# Altium schematic sheet Switches + Blocks.SchDoc
size A3; SheetNumber: 1; SheetTotal: 2
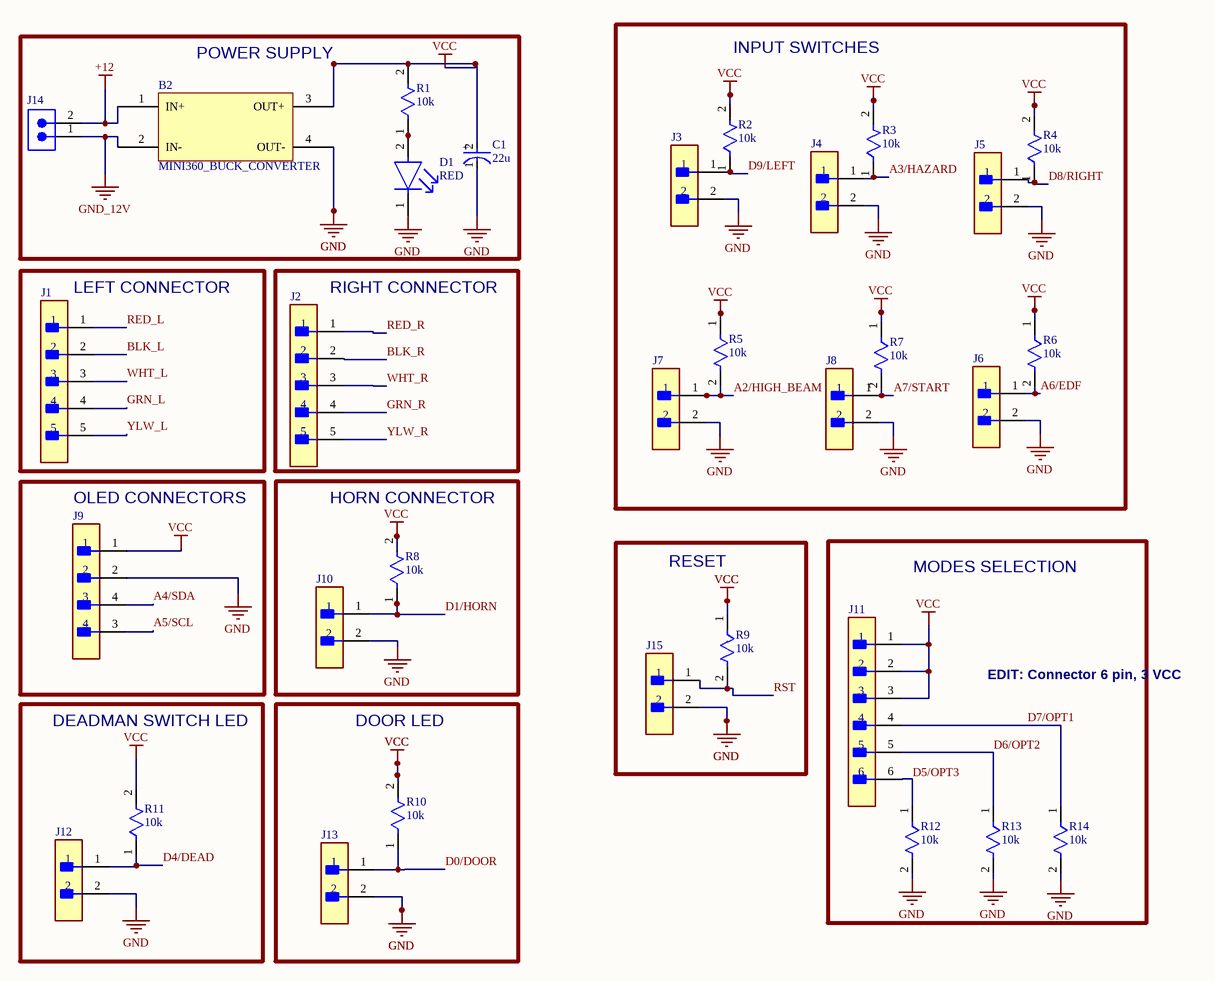
[diagram p0: Switches + Blocks.SchDoc]

## Parts
B2  MINI360_BUCK_CONVERTER  [MINI360_BUCK_CONVERTER]
C1  22u  [FP-RAD-TH-D_5_0_5-L_11_1-MFG]
D1  RED  [FP-6_544-5255_01-4-MFG]
J1  B5B-XH-AM(LF)(SN)  [FP-B5B-XH-AM_LF_SN-MFG]  (value not drawn)
J2  B5B-XH-AM(LF)(SN)  [FP-B5B-XH-AM_LF_SN-MFG]  (value not drawn)
J3  B2B-XH-A(LF)(SN)  [FP-B2B-XH-A_LF_SN-MFG]  (value not drawn)
J4  B2B-XH-A(LF)(SN)  [FP-B2B-XH-A_LF_SN-MFG]  (value not drawn)
J5  B2B-XH-A(LF)(SN)  [FP-B2B-XH-A_LF_SN-MFG]  (value not drawn)
J6  B2B-XH-A(LF)(SN)  [FP-B2B-XH-A_LF_SN-MFG]  (value not drawn)
J7  B2B-XH-A(LF)(SN)  [FP-B2B-XH-A_LF_SN-MFG]  (value not drawn)
J8  B2B-XH-A(LF)(SN)  [FP-B2B-XH-A_LF_SN-MFG]  (value not drawn)
J9  B4B-XH-A(LF)(SN)  [FP-B4B-XH-A_LF_SN-MFG]  (value not drawn)
J10  B2B-XH-A(LF)(SN)  [FP-B2B-XH-A_LF_SN-MFG]  (value not drawn)
J11  B6B-XH-AM(LF)(SN)  [FP-B6B-XH-AM_LF_SN-MFG]  (value not drawn)
J12  B2B-XH-A(LF)(SN)  [FP-B2B-XH-A_LF_SN-MFG]  (value not drawn)
J13  B2B-XH-A(LF)(SN)  [FP-B2B-XH-A_LF_SN-MFG]  (value not drawn)
J14  691312510002  [691312510002]  (value not drawn)
J15  B2B-XH-A(LF)(SN)  [FP-B2B-XH-A_LF_SN-MFG]  (value not drawn)
R1  10k  [PCBComponent_1]
R2  10k  [PCBComponent_1]
R3  10k  [PCBComponent_1]
R4  10k  [PCBComponent_1]
R5  10k  [PCBComponent_1]
R6  10k  [PCBComponent_1]
R7  10k  [PCBComponent_1]
R8  10k  [PCBComponent_1]
R9  10k  [PCBComponent_1]
R10  10k  [PCBComponent_1]
R11  10k  [PCBComponent_1]
R12  10k  [PCBComponent_1]
R13  10k  [PCBComponent_1]
R14  10k  [PCBComponent_1]

## Blocks framed on the sheet
POWER SUPPLY: B2 C1 D1 J14 R1
INPUT SWITCHES: J3-J8 R2-R7
LEFT CONNECTOR: J1
RIGHT CONNECTOR: J2
OLED CONNECTORS: J9
HORN CONNECTOR: J10 R8
MODES SELECTION: J11 R12-R14
RESET: J15 R9
DEADMAN SWITCH LED: J12 R11
DOOR LED: J13 R10

## Nets
+12: B2.1(IN+) J14.2
GND: B2.4(OUT-) C1.1(C) D1.1(C) J3.2 J4.2 J5.2 J6.2 J7.2 J8.2 J9.2 J10.2 J12.2 J13.2 J15.2 R12.2 R13.2 R14.2
GND_12V: B2.2(IN-) J14.1
VCC: B2.3(OUT+) C1.2(A) J9.1 J11.1 J11.2 J11.3 R1.2 R2.2 R3.2 R4.2 R5.1 R6.1 R7.1 R8.2 R9.1 R10.2 R11.2
A2/HIGH_BEAM: J7.1 R5.2
A3/HAZARD: J4.1 R3.1
A4/SDA: J9.4
A5/SCL: J9.3
A6/EDF: J6.1 R6.2
A7/START: J8.1 R7.2
BLK_L: J1.2
BLK_R: J2.2
D0/DOOR: J13.1 R10.1
D1/HORN: J10.1 R8.1
D4/DEAD: J12.1 R11.1
D5/OPT3: J11.6 R12.1
D6/OPT2: J11.5 R13.1
D7/OPT1: J11.4 R14.1
D8/RIGHT: J5.1 R4.1
D9/LEFT: J3.1 R2.1
GRN_L: J1.4
GRN_R: J2.4
RED_L: J1.1
RED_R: J2.1
RST: J15.1 R9.2
WHT_L: J1.3
WHT_R: J2.3
YLW_L: J1.5
YLW_R: J2.5
NetD1_2: D1.2(A) R1.1

## Notes on the sheet
- EDIT: Connector 6 pin, 3 VCC
- (in symbol CMP-05427-001989-1) +

## Library data of the parts
C1 = CMP-05427-001989-1: Aluminum Electrolytic Capacitors (Radial Lead Type) AEC-Q200 Qualified 22uF ±20% 50V; Ripple Current: 155mA; Polarity: Polar; ESR (Equivalent Series Resistance): 1.3R; Life (Hours): 1000Hour; Leakage Current: 3uA; Lead Diameter: 0.5mm; Termination: Radial; Radiation Hardening: No; RoHS Compliant: Yes; Case/Package: Radial; Height: 11mm; Package Quantity: 2000; Min Operating Temperature: -55°C; Length: 11mm; Contact Plating: Tin; Series: FC; Voltage Rating: 50V; Diameter: 5mm; Capacitance: 22uF; Features: General Purpose; Max Operating Temperature: 105°C; Tolerance: 20%; Voltage Rating (DC): 50V; Mount: Through Hole; Impedance: 1.3R; Lead Pitch: 0.197inch; Packaging: Tape and Reel; Height - Seated (Max): 0.472inch
D1 = CMP-00030-55433990-1: TLLG4400 Led, Pcb, Green, 0.63MCD, 3MM, T-1, 7MA, 1.9V, 565NM, 25DEG, 20V, 20MW, -40; Lens Transparency: Diffused; Dominant Wavelength: 575nm; Test Current: 2mA; Viewing Angle: 50°; Lens Style: Circular, Colored, Diffused, Dome, Round; Number of LEDs: 1; Voltage Rating (DC): 2.4V; Luminous Intensity: 1.2mcd; Depth: 3.2mm; Wavelength: 575nm; Color: Green; Schedule B: 8541402000, 8541402000; RoHS: Compliant; Max Operating Temperature: 100°C; Power Dissipation: 20mW; Height: 4.5mm; Number of Pins: 2; Forward Voltage: 1.9V; NexarPartId: 55433990; Max Power Dissipation: 20mW; Length: 3.2mm; Forward Current: 2mA; Min Operating Temperature: -40°C; Illumination Color: Green; Lens Size: 3mm; Reverse Voltage: 20V; Mount: Through Hole; Case/Package: T; Radiation Hardening: No; Number of Elements: 1; REACH SVHC: Unknown; Lens Color: Green
J1 J2 = CMP-17439-000304-1: CONN HEADER VERT 5POS 2.5MM; Mated Stacking Heights: 9.8mm; Voltage Rating: 250V; Max Current Rating: 3A; Number of Positions: 5; Contact Resistance: 20mR; Depth: 5.75mm; Connector Type: Header; Color: Green; Insulation Material: Nylon; Contact Plating: Copper; Length: 14.9mm; Fastening Type: Detent; Contact Material: Brass; Number of Rows: 1; Contact Type: Male Pin; Housing Material: Polyamide; Housing Color: White; Lead Free: Lead Free; Max Voltage Rating (AC): 250V; Mount: Through Hole; Contact Shape: Square; Min Operating Temperature: -25°C; Packaging: Bulk; Orientation: Straight; Insulation Color: Natural; Series: XH; Flammability Rating: UL94 V-0; Contact Finish - Mating: TIN; Max Operating Temperature: 85°C; Termination: Solder; Pitch: 2.5mm
J3-J8 J10 J12 J13 J15 = CMP-2000-05888-3: CONN HEADER VERT 2POS 2.5MM; Current Rating: 3A; Voltage Rating: 250V; Number of Contacts: 2; Contact Resistance: 20mR; Wire/Cable Gauge: 22AWG; Insulation Resistance: 1GR; Connector Type: Male Pin; Packaging: Bulk; Contact Material: Brass; Lead Free: Lead Free; Orientation: Straight; Contact Plating: Tin; Max Current Rating: 3A; Termination: Solder; Fastening Type: Detent; Depth: 5.75mm; Housing Material: Polyamide; REACH SVHC: No SVHC; Series: XH; Voltage Rating (AC): 250V; Number of Positions: 2; Color: Natural; Contact Type: Male Pin; Max Voltage Rating (DC): 250V; Pitch: 2.5mm; Lead Pitch: 2.5mm; Mount: Through Hole; Max Operating Temperature: 85°C; Length: 7.4mm; Max Voltage Rating (AC): 250V; Min Operating Temperature: -25°C; Number of Rows: 1; Housing Color: White
J9 = CMP-17439-000250-1: CONN HEADER VERT 4POS 2.5MM; Number of Contacts: 4; Contact Resistance: 20mR; Voltage Rating: 250V; Max Current Rating: 3A; Gender: Male; Wire/Cable Gauge: 22AWG; Mated Stacking Heights: 9.8mm; Insulation Resistance: 1GR; Orientation: Straight; Contact Type: Male Pin; Contact Finish - Mating: TIN; Series: XH; Max Voltage Rating (AC): 250V; Lead Pitch: 2.5mm; Contact Shape: Square; Insulation Color: Natural; Termination: Solder; Lead Free: Lead Free; Voltage Rating (AC): 250V; Number of Rows: 1; Flammability Rating: UL94 V-0; Number of Positions: 4; Max Operating Temperature: 85°C; Package Quantity: 500; Mount: Through Hole; REACH SVHC: No SVHC; Connector Type: Header; Insulation Material: Nylon; Fastening Type: Detent; Min Operating Temperature: -25°C; Housing Color: White; Packaging: Bulk; Contact Plating: Tin; Contact Material: Brass; Max Voltage Rating (DC): 250V; Housing Material: Polyamide; Color: Natural; Material: Polyamide; Pitch: 2.5mm; Depth: 5.75mm; Current Rating: 3A; Length: 12.4mm
J11 = CMP-17439-000167-1: CONN HEADER VERT 6POS 2.5MM; Shape: Straight; Current Rating: 3A; Mated Stacking Heights: 9.8mm; Number of Positions: 6; Voltage Rating: 250V; Pitch: 2.5mm; Insulation Color: Natural; Number of Pins: 6; Width: 5.75mm; Flammability Rating: UL94 V-0; Packaging: Bulk; Connector Type: Header; Number of Rows: 1; Contact Plating: Copper; Mount: Through Hole; Min Operating Temperature: -25°C; Contact Type: Male Pin; Contact Shape: Square; Fastening Type: Detent; Length: 17.4mm; Series: XH; Contact Finish - Mating: TIN; Max Operating Temperature: 85°C; Insulation Material: Nylon; Number of Poles: 6; Termination: Press-Fit; Contact Material: Brass; Height: 7mm
J14 = CMP-1502-02169-2: NexarPartId: 8917753; Gender: Male; Pitch: 5.08mm; Voltage: 300V; Number of Positions Per Level: 2; Current: 20A; Number of Levels: 1; Number of Pins: 2; Contact Plating: Tin; REACH SVHC: Unknown; Height: 12mm; Mount: Through Hole; Lead Pitch: 5.08mm; Number of Contacts: 2; Contact Material: Brass; Length: 11.5mm; RoHS: Compliant; Color: Green; Termination: Solder; Width: 10.16mm; Number of Rows: 1; Packaging: Box
R1-R14 = RES